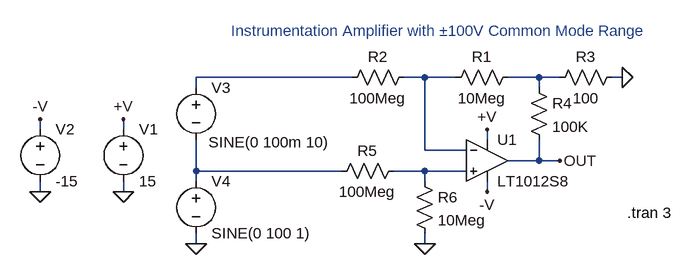
[diagram p0: schematic 1012S8.asc]
1012S8.asc, the LTspice schematic file:
Version 4
SHEET 1 896 680
WIRE -16 112 -256 112
WIRE 96 112 64 112
WIRE 144 112 96 112
WIRE 272 112 224 112
WIRE 304 112 272 112
WIRE 400 112 384 112
WIRE -256 128 -256 112
WIRE 272 128 272 112
WIRE -496 192 -496 176
WIRE -368 192 -368 176
WIRE 192 208 192 192
WIRE 96 224 96 112
WIRE 160 224 96 224
WIRE 272 240 272 208
WIRE 272 240 224 240
WIRE 304 240 272 240
WIRE -256 256 -256 208
WIRE -32 256 -256 256
WIRE 96 256 48 256
WIRE 160 256 96 256
WIRE -256 272 -256 256
WIRE 96 272 96 256
WIRE -496 288 -496 272
WIRE -368 288 -368 272
WIRE 192 288 192 272
WIRE -256 368 -256 352
WIRE 96 368 96 352
FLAG -368 288 0
FLAG 192 192 +V
FLAG -368 176 +V
FLAG 192 288 -V
FLAG -496 288 0
FLAG -496 176 -V
FLAG -256 368 0
FLAG 400 112 0
FLAG 96 368 0
FLAG 304 240 OUT
SYMBOL voltage -368 176 R0
SYMATTR InstName V1
SYMATTR Value 15
SYMBOL voltage -496 176 R0
SYMATTR InstName V2
SYMATTR Value -15
SYMBOL res 240 96 R90
WINDOW 0 0 56 VBottom 2
WINDOW 3 32 56 VTop 2
SYMATTR InstName R1
SYMATTR Value 10Meg
SYMBOL res 80 96 R90
WINDOW 0 0 56 VBottom 2
WINDOW 3 32 56 VTop 2
SYMATTR InstName R2
SYMATTR Value 100Meg
SYMBOL voltage -256 112 R0
WINDOW 3 19 100 Left 2
SYMATTR Value SINE(0 100m 10)
SYMATTR InstName V3
SYMBOL res 400 96 R90
WINDOW 0 0 56 VBottom 2
WINDOW 3 32 56 VTop 2
SYMATTR InstName R3
SYMATTR Value 100
SYMBOL res 256 112 R0
SYMATTR InstName R4
SYMATTR Value 100K
SYMBOL res 64 240 R90
WINDOW 0 0 56 VBottom 2
WINDOW 3 32 56 VTop 2
SYMATTR InstName R5
SYMATTR Value 100Meg
SYMBOL res 80 256 R0
SYMATTR InstName R6
SYMATTR Value 10Meg
SYMBOL voltage -256 256 R0
SYMATTR InstName V4
SYMATTR Value SINE(0 100 1)
SYMBOL opamps\\LT1012S8 192 176 R0
SYMATTR InstName U1
TEXT 408 320 Left 2 !.tran 3
TEXT 120 56 Bottom 2 ;Instrumentation Amplifier with ±100V Common Mode Range

The netlist it stands for:
* 1012S8.asc
V1 +V 0 15
V2 -V 0 -15
R1 N003 N002 10Meg
R2 N002 N001 100Meg
V3 N001 N004 SINE(0 100m 10)
R3 0 N003 100
R4 N003 OUT 100K
R5 N005 N004 100Meg
R6 N005 0 10Meg
V4 N004 0 SINE(0 100 1)
XU1 N005 N002 +V -V OUT LT1012S8  ; pins In+ In- V+ V- OUT
.tran 3
* Instrumentation Amplifier with ±100V Common Mode Range
.backanno
.end